# Altium schematic sheet 4-Mode Regulator Schematic.SchDoc
size A4; SheetNumber: 1; SheetTotal: 1
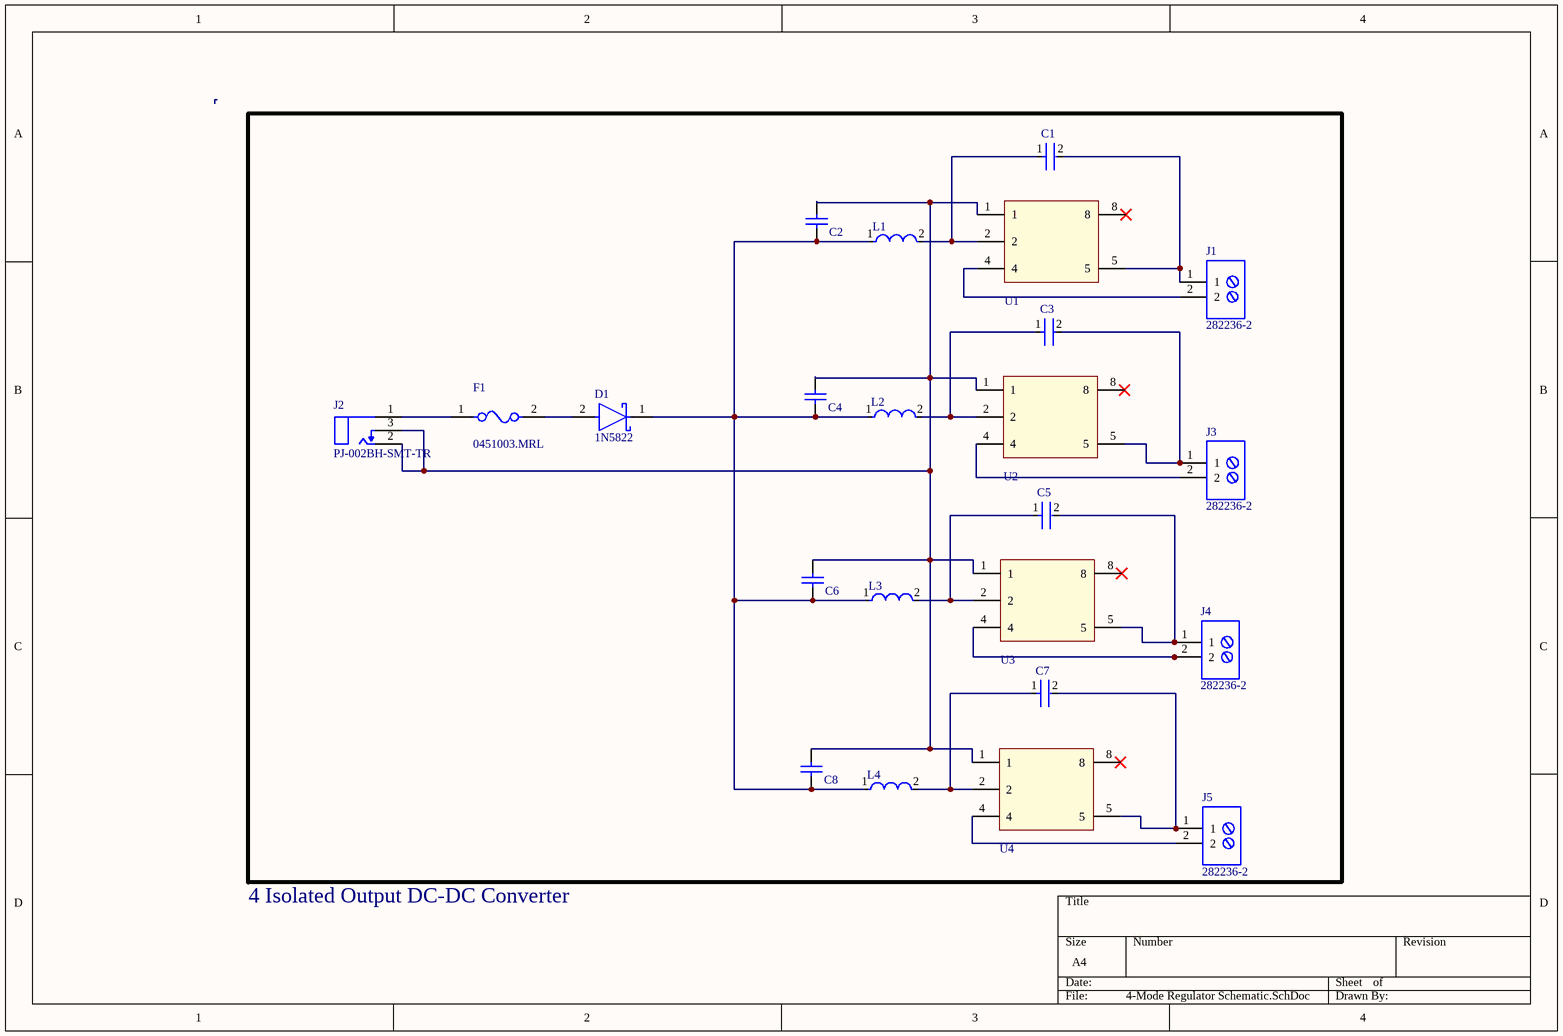
[diagram p0: 4-Mode Regulator Schematic.SchDoc]

## Parts
C1  HV1812Y471KXMATHV  [FP-HV1812-IPC_C]  (value not drawn)
C2  GRM21BR71C225KA12L  [CAPC2013X135X50ML10T20]  (value not drawn)
C3  HV1812Y471KXMATHV  [FP-HV1812-IPC_C]  (value not drawn)
C4  GRM21BR71C225KA12L  [CAPC2013X135X50ML10T20]  (value not drawn)
C5  HV1812Y471KXMATHV  [FP-HV1812-IPC_C]  (value not drawn)
C6  GRM21BR71C225KA12L  [CAPC2013X135X50ML10T20]  (value not drawn)
C7  HV1812Y471KXMATHV  [FP-HV1812-IPC_C]  (value not drawn)
C8  GRM21BR71C225KA12L  [CAPC2013X135X50ML10T20]  (value not drawn)
D1  1N5822  [FP-B-Body-MFG]
F1  0451003.MRL  [FP-0451-MFG]
J1  282236-2  [282236-2]
J2  PJ-002BH-SMT-TR  [FP-PJ-002BH-SMT-TR-MFG]
J3  282236-2  [282236-2]
J4  282236-2  [282236-2]
J5  282236-2  [282236-2]
L1  IHLP2020BZER100M01  [FP-IHLP-2020BZ-FP_1_905x2-MFG]  (value not drawn)
L2  IHLP2020BZER100M01  [FP-IHLP-2020BZ-FP_1_905x2-MFG]  (value not drawn)
L3  IHLP2020BZER100M01  [FP-IHLP-2020BZ-FP_1_905x2-MFG]  (value not drawn)
L4  IHLP2020BZER100M01  [FP-IHLP-2020BZ-FP_1_905x2-MFG]  (value not drawn)
U1  8-SMD Module, 5 Leads  [8-SMD Module, 5 Leads]  (value not drawn)
U2  8-SMD Module, 5 Leads  [8-SMD Module, 5 Leads]  (value not drawn)
U3  8-SMD Module, 5 Leads  [8-SMD Module, 5 Leads]  (value not drawn)
U4  8-SMD Module, 5 Leads  [8-SMD Module, 5 Leads]  (value not drawn)

## Nets
NetC1_1: C1.1 L1.2 U1.2
NetC1_2: C1.2 J1.1 U1.5
NetC2_1: C2.1 C4.1 C6.1 C8.1 D1.1(C) L1.1 L2.1 L3.1 L4.1
NetC2_2: C2.2 C4.2 C6.2 C8.2 J2.2 J2.3 U1.1 U2.1 U3.1 U4.1
NetC3_1: C3.1 L2.2 U2.2
NetC3_2: C3.2 J3.1 U2.5
NetC5_1: C5.1 L3.2 U3.2
NetC5_2: C5.2 J4.1 U3.5
NetC7_1: C7.1 L4.2 U4.2
NetC7_2: C7.2 J5.1 U4.5
NetD1_2: D1.2(A) F1.2
NetF1_1: F1.1 J2.1
NetJ1_2: J1.2 U1.4
NetJ3_2: J3.2 U2.4
NetJ4_2: J4.2 U3.4
NetJ5_2: J5.2 U4.4

Not connected (* = marked no-connect by the designer): U1 8*; U2 8*; U3 8*; U4 8*

## Notes on the sheet
- 4 Isolated Output DC-DC Converter

## Library data of the parts
C1 C3 C5 C7 = CMP-02417-000043-1: CAP CER 470PF 5KV X7R 1812; Tolerance: 10%; Packaging: Cut Tape; Voltage Rating (DC): 5kV; Min Operating Temperature: -55°C; Length: 0.177inch; Max Operating Temperature: 125°C; Mount: Surface Mount; Case Code (Imperial): 1812; REACH SVHC: No SVHC; RoHS Compliant: Yes; Capacitance: 470pF; Thickness: 0.106inch; Case/Package: 1812; Case Code (Metric): 4532; Voltage Rating: 5kV; Dielectric: X7R; Width: 0.126inch
C2 C4 C6 C8 = CMP-2007-03455-1: Manufacturer: Murata; Part Number: GRM21BR71C225KA12L
D1 = CMP-00252-09163648-1: 1N5822 Diode Schottky 40V 3A 2-Pin Axial B-MELF Bag - Bulk; Max Forward Surge Current (Ifsm): 80A; Max Junction Temperature (Tj): 125°C; Forward Voltage: 700mV; Peak Non-Repetitive Surge Current: 150A; Element Configuration: Single; Peak Reverse Current: 100µA; Max Reverse Voltage (DC): 40V; Max Repetitive Reverse Voltage (Vrrm): 40V; RoHS: Compliant; Number of Pins: 2; Average Rectified Current: 3A; NexarPartId: 9163648; Lifecycle Status: Production; Contact Plating: Lead, Tin; Case/Package: Axial; Mount: Through Hole; Max Operating Temperature: 125°C; Height: 3.61mm; Min Operating Temperature: -65°C; Reverse Voltage: 40V; Forward Current: 3A
F1 = CMP-08605-000063-1: FUSE BRD MNT 3A 125VAC/VDC 2SMD; Manufacturer: Littelfuse Inc; Fuse Interrupt Ac Current: 50A; Voltage Rating: 125V; Fuse I2T: 1.65A2Sec; Resistance: 0.0227Ω; Fuse Blow Speed: Fast; Value: 0.0227Ω; RoHS: TRUE; Automotive: No; Max Fuse Dc Voltage: 125V; Mouser Description: Surface Mount Fuses 125V 3A; Package: 0451; Device Class L2: Fuses; Fuse Current: 3A; Manufacturer Part Number: 0451003.MRL; ComponentLink2Description: Datasheet; Lead Free: Yes; Temperature Range Low: -55°C; Max Fuse Ac Voltage: 125V; Temperature: -55°C to +125°C; Device Class L1: Circuit Protection; Octopart: https://octopart.com/0451003.mrl-littelfuse-566380; Category: Fuse; Height: 2.94mm; Temperature Range High: +125°C; ComponentLink2URL: https://www.littelfuse.com/~/media/electronics/datasheets/fuses/littelfuse_fuse_451_453_datasheet.pdf.pdf; Digikey Description: FUSE BRD MNT 3A 125VAC/VDC 2SMD; Device Class L3: unset; Fuse Interrupt Dc Current: 50A
J1 J3-J5 = 282236-2: Modular Terminal Block, 13.5A, 1.5mm2, 1 Row(s), 1 Deck(s); Manufacturer: TE Connectivity; Manufacturer Part Number: 282836-2; Manufacturer Series: 282836; Fastening Method: SCREW; Number of Decks: 1; Number of Ways: 2; Voltage Rating: 300V; Wire/Cable Gauge: 15AWG; Safety Approval: UL; Supplier: Future Electronics; Supplier Part Number: 4188728; RoHS: Yes; Category: Terminal Blocks; Stock: 130643; Pricing: 300=0,37, 900=0,36, 1200=0,39, 1500=0,35, 3000=0,345, 4500=0,37, 6000=0,33 (USD); Mounting Technology: Board; Number of Rows: 1; Current Rating: 13.5A; Terminal and Terminal Block Type: MODULAR TERMINAL BLOCK; Wire Cross Section: 1.5mm2; RoHS Compliant: Yes; Reach SVHC Compliant: No; ComponentLink1URL: https://datasheet.ciiva.com:443/pdfs/VipMasterIC/IC/TYEL/TYEL-S-A0008743874/TYEL-S-A0008711552-1.pdf?src-supplier=IHS+Markit; ComponentLink1Description: https://datasheet.ciiva.com:443/pdfs/VipMasterIC/IC/TYEL/TYEL-S-A0008743874/TYEL-S-A0008711552-1.pdf?src-supplier=IHS+Markit; ComponentLink2URL: https://datasheet.ciiva.com/16393/282836-2-16393382.pdf?src-supplier=Future+Electronics; ComponentLink2Description: https://datasheet.ciiva.com/16393/282836-2-16393382.pdf?src-supplier=Future+Electronics; ComponentLink3URL: https://datasheet.ciiva.com/15169/getdatasheetpartid-155855-15169553.pdf?src-supplier=Verical; ComponentLink3Description: https://datasheet.ciiva.com/15169/getdatasheetpartid-155855-15169553.pdf?src-supplier=Verical; ComponentLink4URL: https://datasheet.ciiva.com/3141/eng-cs-1308389-eurostyle-terminal-blocks-0607-3141118.pdf?src-supplier=Avnet; ComponentLink4Description: https://datasheet.ciiva.com/3141/eng-cs-1308389-eurostyle-terminal-blocks-0607-3141118.pdf?src-supplier=Avnet
J2 = CMP-2000-06897-2: CONN PWR JACK 2.5X5.5MM SOLDER; Manufacturer: CUI Inc; Current Rating: 5A; Standoff Height: 0.1mm; Voltage Rating: 24V; Conn Gender: Male; Conn Orientation: Right Angle; Number Of Contacts: 3; Temperature Range Low: -25°C; Category: Conn; Package: 0; Device Class L2: Power Connectors; Contact Material: Nickel,Silver; Automotive: No; Mouser Description: 2.5 mm Center Pin, 5.0 A, Right Angle, Surface Mount (SMT), Dc Power Jack Connector; Device Class L3: unset; ComponentLink2URL: https://www.cuidevices.com/product/resource/digikeypdf/pj-002bh-smt-tr.pdf; Octopart: https://octopart.com/pj-002bh-smt-tr-cui-25947151; Manufacturer Part Number: PJ-002BH-SMT-TR; Lead Free: Yes; ComponentLink2Description: Datasheet; Digikey Description: CONN PWR JACK 2.5X5.5MM SOLDER; Height: 11.43mm; Temperature: -25°C to +85°C; RoHS: TRUE; Device Class L1: Connectors; Temperature Range High: +85°C
L1-L4 = CMP-02424-000159-1: Fixed Inductors Commercial High Saturation Series 10uH 2.3A 199mΩ 20%; Test Frequency: 100kHz; Saturation Current: 4A; Self Resonant Frequency: 20MHz; DC Resistance (DCR): 199mR; Core Material: Ferrite; Shielding: Shielded; RMS Current (Irms): 2.3A; Length: 5.49mm; Height - Seated (Max): 0.079inch; Tolerance: 20%; Number of Pins: 2020; Height: 2mm; Packaging: Tape and Reel; Case/Package: 2020; Lead Free: Lead Free; Width: 0.204inch; Inductance Tolerance: 20%; Inductance: 10uH; Depth: 5.43mm; Termination: SMD/SMT; Radiation Hardening: No; Min Operating Temperature: -55°C; Max Operating Temperature: 125°C; Mount: Surface Mount; Current Rating: 2.3A; Package Quantity: 2000; Military Standard: Not; Max DC Current: 2.3A
U1-U4 = 8-SMD Module, 5 Leads: 8-SMD Module, 5 Leads ICs; ComponentLink1Description: Datasheet; ComponentLink1URL: https://recom-power.com/pdf/Econoline/R1S_R1D.pdf; Supplier 1: Digikey; Created By: Arda Kara